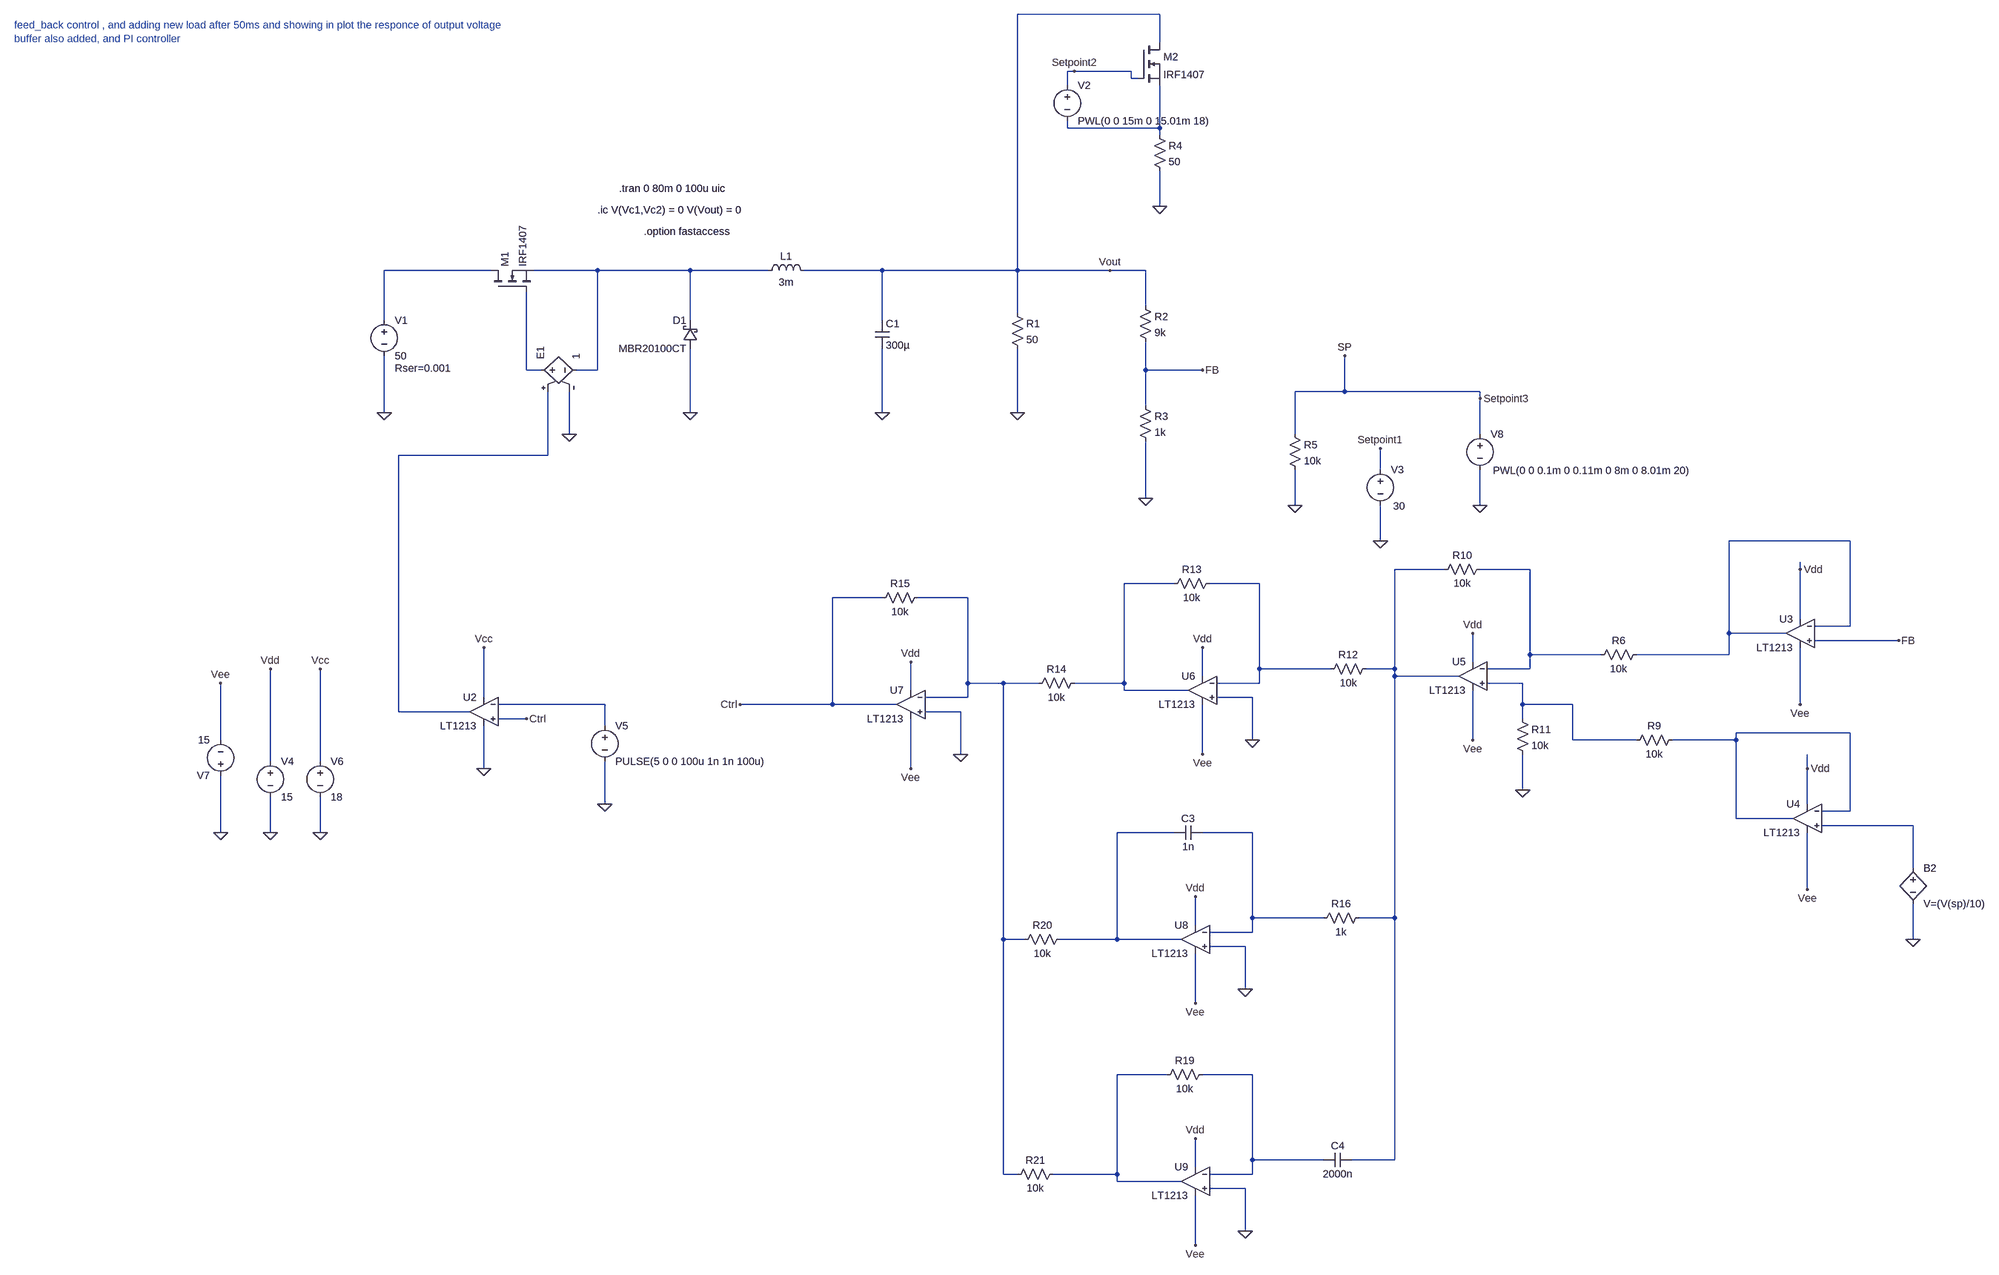
[diagram p0: schematic buck-converter-with PID controler.asc]
buck-converter-with PID controler.asc, the LTspice schematic file:
Version 4
SHEET 1 3788 3240
WIRE 912 -304 592 -304
WIRE 912 -240 912 -304
WIRE 720 -176 704 -176
WIRE 848 -176 720 -176
WIRE 848 -160 848 -176
WIRE 864 -160 848 -160
WIRE 704 -144 704 -176
WIRE 704 -48 704 -64
WIRE 912 -48 912 -144
WIRE 912 -48 704 -48
WIRE 912 -32 912 -48
WIRE 912 128 912 48
WIRE -592 272 -832 272
WIRE -352 272 -496 272
WIRE -144 272 -352 272
WIRE 32 272 -144 272
WIRE 288 272 112 272
WIRE 592 272 592 -304
WIRE 592 272 288 272
WIRE 800 272 592 272
WIRE 880 272 800 272
WIRE 880 352 880 272
WIRE 592 368 592 272
WIRE -832 384 -832 272
WIRE -144 384 -144 272
WIRE 288 384 288 272
WIRE -512 496 -512 320
WIRE -480 496 -512 496
WIRE -352 496 -352 272
WIRE -352 496 -400 496
WIRE 880 496 880 432
WIRE 1008 496 880 496
WIRE 1328 544 1328 464
WIRE 1328 544 1216 544
WIRE 1632 544 1328 544
WIRE 1632 560 1632 544
WIRE 880 576 880 496
WIRE -832 592 -832 464
WIRE -144 592 -144 448
WIRE 288 592 288 448
WIRE 592 592 592 448
WIRE -416 640 -416 544
WIRE 1216 640 1216 544
WIRE 1632 640 1632 560
WIRE -464 688 -464 544
WIRE -464 688 -800 688
WIRE 1408 720 1408 672
WIRE 880 784 880 656
WIRE 1216 800 1216 720
WIRE 1632 800 1632 720
WIRE 1408 880 1408 800
WIRE 2464 880 2192 880
WIRE 1552 944 1440 944
WIRE 1744 944 1632 944
WIRE 2352 944 2352 928
WIRE 944 976 832 976
WIRE 1136 976 1024 976
WIRE 288 1008 176 1008
WIRE 480 1008 368 1008
WIRE 2352 1056 2352 944
WIRE 2464 1072 2464 880
WIRE 2464 1072 2384 1072
WIRE 2192 1088 2192 880
WIRE 2320 1088 2192 1088
WIRE 2592 1104 2384 1104
WIRE 1744 1136 1744 944
WIRE 1904 1136 1744 1136
WIRE 2192 1136 2192 1088
WIRE 2192 1136 1984 1136
WIRE 1616 1152 1616 1088
WIRE 1136 1168 1136 976
WIRE 1296 1168 1136 1168
WIRE 1440 1168 1440 944
WIRE 1440 1168 1376 1168
WIRE 1744 1168 1744 1136
WIRE 1744 1168 1648 1168
WIRE 1008 1184 1008 1120
WIRE 1440 1184 1440 1168
WIRE 1584 1184 1440 1184
WIRE 480 1200 480 1008
WIRE 560 1200 480 1200
WIRE 640 1200 560 1200
WIRE 832 1200 832 976
WIRE 832 1200 720 1200
WIRE 1136 1200 1136 1168
WIRE 1136 1200 1040 1200
WIRE 1728 1200 1648 1200
WIRE 352 1216 352 1152
WIRE 832 1216 832 1200
WIRE 976 1216 832 1216
WIRE -608 1232 -608 1120
WIRE 480 1232 480 1200
WIRE 480 1232 384 1232
WIRE 1120 1232 1040 1232
WIRE -336 1248 -576 1248
WIRE 176 1248 176 1008
WIRE 176 1248 -32 1248
WIRE 320 1248 176 1248
WIRE 1728 1248 1728 1200
WIRE 1840 1248 1728 1248
WIRE 2352 1248 2352 1120
WIRE -800 1264 -800 688
WIRE -640 1264 -800 1264
WIRE 464 1264 384 1264
WIRE -512 1280 -576 1280
WIRE 1728 1280 1728 1248
WIRE -336 1296 -336 1248
WIRE 2464 1312 2208 1312
WIRE -1200 1328 -1200 1200
WIRE 1120 1328 1120 1232
WIRE 1616 1328 1616 1216
WIRE 1840 1328 1840 1248
WIRE 1984 1328 1840 1328
WIRE 2208 1328 2208 1312
WIRE 2208 1328 2064 1328
WIRE 464 1360 464 1264
WIRE 1008 1360 1008 1248
WIRE -1088 1376 -1088 1168
WIRE -976 1376 -976 1168
WIRE -608 1392 -608 1296
WIRE 352 1392 352 1280
WIRE 2368 1392 2368 1360
WIRE 1728 1440 1728 1360
WIRE -336 1472 -336 1376
WIRE 2368 1472 2368 1392
WIRE 2464 1488 2464 1312
WIRE 2464 1488 2400 1488
WIRE 2208 1504 2208 1328
WIRE 2336 1504 2208 1504
WIRE 2624 1520 2400 1520
WIRE -1200 1536 -1200 1408
WIRE -1088 1536 -1088 1456
WIRE -976 1536 -976 1456
WIRE 944 1536 816 1536
WIRE 1120 1536 1008 1536
WIRE 2624 1616 2624 1520
WIRE 2368 1664 2368 1536
WIRE 1120 1728 1120 1536
WIRE 1280 1728 1120 1728
WIRE 1440 1728 1440 1184
WIRE 1440 1728 1360 1728
WIRE 992 1744 992 1680
WIRE 1120 1760 1120 1728
WIRE 1120 1760 1024 1760
WIRE 560 1776 560 1200
WIRE 608 1776 560 1776
WIRE 816 1776 816 1536
WIRE 816 1776 688 1776
WIRE 960 1776 816 1776
WIRE 2624 1776 2624 1696
WIRE 1104 1792 1024 1792
WIRE 1104 1888 1104 1792
WIRE 992 1920 992 1808
WIRE 928 2080 816 2080
WIRE 1120 2080 1008 2080
WIRE 1120 2272 1120 2080
WIRE 1280 2272 1120 2272
WIRE 1440 2272 1440 1728
WIRE 1440 2272 1344 2272
WIRE 992 2288 992 2224
WIRE 560 2304 560 1776
WIRE 592 2304 560 2304
WIRE 816 2304 816 2080
WIRE 816 2304 672 2304
WIRE 1120 2304 1120 2272
WIRE 1120 2304 1024 2304
WIRE 816 2320 816 2304
WIRE 960 2320 816 2320
WIRE 1104 2336 1024 2336
WIRE 1104 2432 1104 2336
WIRE 992 2464 992 2352
FLAG -832 592 0
FLAG -144 592 0
FLAG 288 592 0
FLAG 592 592 0
FLAG 880 784 0
FLAG 1008 496 FB
FLAG 912 128 0
FLAG 720 -176 Setpoint2
FLAG 1216 800 0
FLAG 1408 880 0
FLAG 1328 464 SP
FLAG 1408 672 Setpoint1
FLAG -336 1472 0
FLAG -608 1392 0
FLAG -608 1120 Vcc
FLAG -976 1536 0
FLAG -1200 1536 0
FLAG -1200 1200 Vee
FLAG -976 1168 Vcc
FLAG -416 640 0
FLAG 800 272 Vout
FLAG 2352 944 Vdd
FLAG 2352 1248 Vee
FLAG 2592 1104 FB
FLAG 2368 1392 Vdd
FLAG 2368 1664 Vee
FLAG 1616 1088 Vdd
FLAG 1616 1328 Vee
FLAG 1728 1440 0
FLAG 1008 1120 Vdd
FLAG 1008 1360 Vee
FLAG 1120 1328 0
FLAG 352 1152 Vdd
FLAG 352 1392 Vee
FLAG 464 1360 0
FLAG 992 1680 Vdd
FLAG 992 1920 Vee
FLAG 1104 1888 0
FLAG 992 2224 Vdd
FLAG 992 2464 Vee
FLAG 1104 2432 0
FLAG 2624 1776 0
FLAG -32 1248 Ctrl
FLAG -512 1280 Ctrl
FLAG -1088 1536 0
FLAG -1088 1168 Vdd
FLAG 1632 800 0
FLAG 1632 560 Setpoint3
SYMBOL voltage -832 368 R0
WINDOW 123 0 0 Left 0
WINDOW 39 24 124 Left 2
SYMATTR SpiceLine Rser=0.001
SYMATTR InstName V1
SYMATTR Value 50
SYMBOL nmos -592 320 R270
SYMATTR InstName M1
SYMATTR Value IRF1407
SYMBOL ind 16 288 R270
WINDOW 0 32 56 VTop 2
WINDOW 3 5 56 VBottom 2
SYMATTR InstName L1
SYMATTR Value 3m
SYMATTR SpiceLine Rser=0.001
SYMBOL res 576 352 R0
SYMATTR InstName R1
SYMATTR Value 50
SYMBOL cap 272 384 R0
SYMATTR InstName C1
SYMATTR Value 300µ
SYMBOL schottky -128 448 R180
WINDOW 0 24 64 Left 2
WINDOW 3 24 0 Left 2
SYMATTR InstName D1
SYMATTR Value MBR20100CT
SYMATTR Description Diode
SYMATTR Type diode
SYMBOL res 864 336 R0
SYMATTR InstName R2
SYMATTR Value 9k
SYMBOL res 864 560 R0
SYMATTR InstName R3
SYMATTR Value 1k
SYMBOL voltage 704 -160 R0
WINDOW 123 0 0 Left 0
WINDOW 39 0 0 Left 0
SYMATTR InstName V2
SYMATTR Value PWL(0 0 15m 0 15.01m 18)
SYMBOL res 896 -48 R0
SYMATTR InstName R4
SYMATTR Value 50
SYMBOL nmos 864 -240 R0
SYMATTR InstName M2
SYMATTR Value IRF1407
SYMBOL voltage 1408 704 R0
WINDOW 3 29 98 Left 2
WINDOW 123 0 0 Left 0
WINDOW 39 0 0 Left 0
SYMATTR Value 30
SYMATTR InstName V3
SYMBOL res 1200 624 R0
SYMATTR InstName R5
SYMATTR Value 10k
SYMBOL res 2000 1120 R90
WINDOW 0 0 56 VBottom 2
WINDOW 3 32 56 VTop 2
SYMATTR InstName R6
SYMATTR Value 10k
SYMBOL OpAmps\\LT1213 -608 1200 M0
SYMATTR InstName U2
SYMBOL voltage -336 1280 R0
WINDOW 123 0 0 Left 0
WINDOW 39 0 0 Left 0
SYMATTR InstName V5
SYMATTR Value PULSE(5 0 0 100u 1n 1n 100u)
SYMBOL voltage -976 1360 R0
WINDOW 123 0 0 Left 0
WINDOW 39 0 0 Left 0
SYMATTR InstName V6
SYMATTR Value 18
SYMBOL voltage -1200 1424 R180
WINDOW 123 0 0 Left 0
WINDOW 39 0 0 Left 0
SYMATTR InstName V7
SYMATTR Value 15
SYMBOL e -496 496 R270
SYMATTR InstName E1
SYMATTR Value 1
SYMBOL OpAmps\\LT1213 2352 1024 M0
SYMATTR InstName U3
SYMBOL res 2080 1312 R90
WINDOW 0 0 56 VBottom 2
WINDOW 3 32 56 VTop 2
SYMATTR InstName R9
SYMATTR Value 10k
SYMBOL OpAmps\\LT1213 2368 1440 M0
SYMATTR InstName U4
SYMBOL OpAmps\\LT1213 1616 1120 M0
SYMATTR InstName U5
SYMBOL res 1648 928 R90
WINDOW 0 0 56 VBottom 2
WINDOW 3 32 56 VTop 2
SYMATTR InstName R10
SYMATTR Value 10k
SYMBOL res 1712 1264 R0
SYMATTR InstName R11
SYMATTR Value 10k
SYMBOL res 1392 1152 R90
WINDOW 0 0 56 VBottom 2
WINDOW 3 32 56 VTop 2
SYMATTR InstName R12
SYMATTR Value 10k
SYMBOL OpAmps\\LT1213 1008 1152 M0
SYMATTR InstName U6
SYMBOL res 1040 960 R90
WINDOW 0 0 56 VBottom 2
WINDOW 3 32 56 VTop 2
SYMATTR InstName R13
SYMATTR Value 10k
SYMBOL res 736 1184 R90
WINDOW 0 0 56 VBottom 2
WINDOW 3 32 56 VTop 2
SYMATTR InstName R14
SYMATTR Value 10k
SYMBOL OpAmps\\LT1213 352 1184 M0
SYMATTR InstName U7
SYMBOL res 384 992 R90
WINDOW 0 0 56 VBottom 2
WINDOW 3 32 56 VTop 2
SYMATTR InstName R15
SYMATTR Value 10k
SYMBOL res 1376 1712 R90
WINDOW 0 0 56 VBottom 2
WINDOW 3 32 56 VTop 2
SYMATTR InstName R16
SYMATTR Value 1k
SYMBOL OpAmps\\LT1213 992 1712 M0
SYMATTR InstName U8
SYMBOL OpAmps\\LT1213 992 2256 M0
SYMATTR InstName U9
SYMBOL res 1024 2064 R90
WINDOW 0 0 56 VBottom 2
WINDOW 3 32 56 VTop 2
SYMATTR InstName R19
SYMATTR Value 10k
SYMBOL res 704 1760 R90
WINDOW 0 0 56 VBottom 2
WINDOW 3 32 56 VTop 2
SYMATTR InstName R20
SYMATTR Value 10k
SYMBOL res 688 2288 R90
WINDOW 0 0 56 VBottom 2
WINDOW 3 32 56 VTop 2
SYMATTR InstName R21
SYMATTR Value 10k
SYMBOL cap 1008 1520 R90
WINDOW 0 0 32 VBottom 2
WINDOW 3 32 32 VTop 2
SYMATTR InstName C3
SYMATTR Value 1n
SYMBOL cap 1344 2256 R90
WINDOW 0 0 32 VBottom 2
WINDOW 3 32 32 VTop 2
SYMATTR InstName C4
SYMATTR Value 2000n
SYMBOL bv 2624 1600 R0
SYMATTR InstName B2
SYMATTR Value V=(V(sp)/10)
SYMBOL voltage -1088 1360 R0
WINDOW 123 0 0 Left 0
WINDOW 39 0 0 Left 0
SYMATTR InstName V4
SYMATTR Value 15
SYMBOL voltage 1632 624 R0
WINDOW 3 29 98 Left 2
WINDOW 123 0 0 Left 0
WINDOW 39 0 0 Left 0
SYMATTR Value PWL(0 0 0.1m 0 0.11m 0 8m 0 8.01m 20)
SYMATTR InstName V8
TEXT -304 88 Left 2 !.tran 0 80m 0 100u uic
TEXT -352 136 Left 2 !.ic V(Vc1,Vc2) = 0 V(Vout) = 0
TEXT -1664 -280 Left 2 ;feed_back control , and adding new load after 50ms and showing in plot the responce of output voltage\nbuffer also added, and PI controller
TEXT -248 184 Left 2 !.option fastaccess

The netlist it stands for:
* buck-converter-with PID controler.asc
V1 N002 0 50 Rser=0.001
M1 N002 N004 N003 N003 IRF1407
L1 N003 Vout 3m Rser=0.001
R1 Vout 0 50
C1 Vout 0 300µ
D1 0 N003 MBR20100CT
R2 Vout FB 9k
R3 FB 0 1k
V2 Setpoint2 N001 PWL(0 0 15m 0 15.01m 18)
R4 N001 0 50
M2 Vout Setpoint2 N001 N001 IRF1407
V3 Setpoint1 0 30
R5 Setpoint3 0 10k
R6 N006 N008 10k
XU2 Ctrl N013 Vcc 0 N005 LT1213  ; pins In+ In- V+ V- OUT
V5 N013 0 PULSE(5 0 0 100u 1n 1n 100u)
V6 Vcc 0 18
V7 0 Vee 15
E1 N004 N003 N005 0 1
XU3 FB N006 Vdd Vee N006 LT1213  ; pins In+ In- V+ V- OUT
R9 N014 N012 10k
XU4 N015 N014 Vdd Vee N014 LT1213  ; pins In+ In- V+ V- OUT
XU5 N012 N008 Vdd Vee N007 LT1213  ; pins In+ In- V+ V- OUT
R10 N008 N007 10k
R11 N012 0 10k
R12 N007 N010 10k
XU6 0 N010 Vdd Vee N009 LT1213  ; pins In+ In- V+ V- OUT
R13 N010 N009 10k
R14 N009 N011 10k
XU7 0 N011 Vdd Vee Ctrl LT1213  ; pins In+ In- V+ V- OUT
R15 N011 Ctrl 10k
R16 N007 N017 1k
XU8 0 N017 Vdd Vee N016 LT1213  ; pins In+ In- V+ V- OUT
XU9 0 N019 Vdd Vee N018 LT1213  ; pins In+ In- V+ V- OUT
R19 N019 N018 10k
R20 N016 N011 10k
R21 N018 N011 10k
C3 N017 N016 1n
C4 N007 N019 2000n
B2 N015 0 V=(V(sp)/10)
V4 Vdd 0 15
V8 Setpoint3 0 PWL(0 0 0.1m 0 0.11m 0 8m 0 8.01m 20)
.model D D
.lib standard.dio
.model NMOS NMOS
.model PMOS PMOS
.lib standard.mos
.tran 0 80m 0 100u uic
.ic V(Vc1,Vc2) = 0 V(Vout) = 0
* feed_back control , and adding new load after 50ms and showing in plot the responce of output voltage
* buffer also added, and PI controller
.option fastaccess
.lib LTC.lib
.backanno
.end